# Altium project Testkit_Interposer.PrjPcb
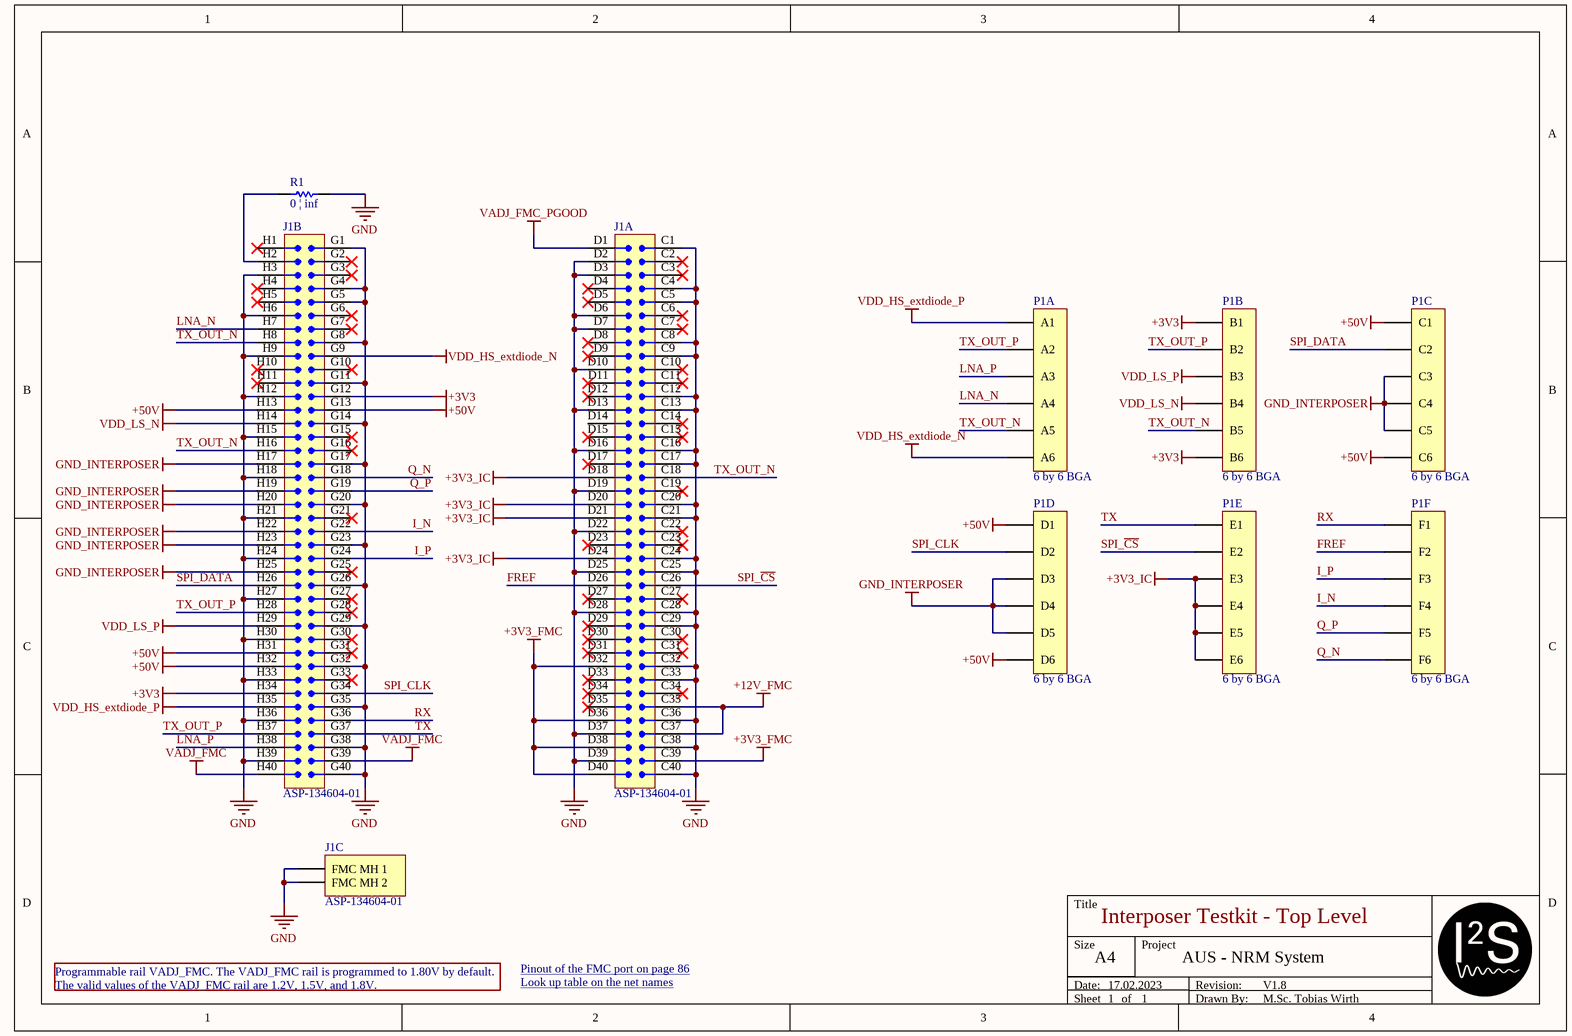
[diagram p0: Top_Level.SchDoc]
SCH_REV: A; PCB_REV: A; PCB_PART_NUMBER: <PCB PN>; PCB_ENGINEER_APP_DATE: --/--/----; PCB_ENGINEER: - -----; PCB_DWG_NO: <PCB DWG NO>; PCB_DESIGNER_APP_DATE: --/--/----; PCB_DESIGNER: - -----; PCB_CHECKER_APP_DATE: --/--/----; PCB_CHECKER: - -----; PCB_ASSEMBLY_NO: <PCB ASSY NO>; PCB_ANG_TOL: +/-1/2; PCB_3_DEC_TOL: +/-.010; PCB_2_DEC_TOL: +/-.01; DOC_NO_SCH_DWG: <SCH DWG NO>; DOC_NO_FAB_DWG: <FAB DWG NO>; DOC_NO_BOM: <BOM DOC NO>; DOC_NO_ASSY_DWG: <ASSY DWG NO>; CONTRACT_NUMBER: <CONTRACT NO>; CAGE_CODE: ?????
1 sheet, 3 parts. Net scope: global (net labels, ports and power ports of the same name join across sheets).
Board file: Testkit_v1.PcbDoc

## Sheet Top_Level.SchDoc: Interposer Testkit - Top Level
size A4; Date: 17.02.2023; ApprovedBy: Prof. Dr. Jens Anders; Author: M.Sc. Tobias Wirth; CompanyName: IIS; DrawnBy: M.Sc. Tobias Wirth; Engineer: M.Sc. Tobias Wirth; Organization: University of Stuttgart; Address1: Pfaffenwaldring 47; Address2: 70569 Stuttgart; Revision: V1.8; SheetNumber: 1; SheetTotal: 1; Project: Austrailia - NMR System; ENG_APP_DATE: --/--/--; DSN_APP_DATE: --/--/--; CHK_APP_DATE: --/--/--; ProjectNameAlt: AUS - NRM System; Time: 19:00

### Parts
J1  ASP-134604-01  [ASP13460401]  (parts A,B,C of 3)
P1  6 by 6 BGA  [BGA36C230P6X6_1500X1500X190 - Interposer]  (parts A,B,C,D,E,F of 6)
R1  0 | inf  [RES_0603]

### Nets
+3V3: J1.G12 J1.H34 P1.B1 P1.B6
+3V3_FMC: J1.C39 J1.D32 J1.D36 J1.D38 J1.D40
+3V3_IC: J1.D18 J1.D20 J1.D21 J1.D24 P1.E3 P1.E4 P1.E5 P1.E6
+12V_FMC: J1.C35 J1.C37
+50V: J1.G13 J1.H13 J1.H31 J1.H32 P1.C1 P1.C6 P1.D1 P1.D6
GND: J1.C1 J1.C4 J1.C5 J1.C8 J1.C9 J1.C12 J1.C13 J1.C16 J1.C17 J1.C20 J1.C21 J1.C24 J1.C25 J1.C28 J1.C29 J1.C32 J1.C33 J1.C36 J1.C38 J1.C40 J1.D2 J1.D3 J1.D6 J1.D7 J1.D10 J1.D13 J1.D16 J1.D19 J1.D22 J1.D25 J1.D28 J1.D37 J1.D39 J1.G1 J1.G4 J1.G5 J1.G8 J1.G11 J1.G14 J1.G17 J1.G20 J1.G23 J1.G26 J1.G29 J1.G32 J1.G35 J1.G38 J1.G40 J1.H3 J1.H6 J1.H9 J1.H12 J1.H15 J1.H18 J1.H21 J1.H24 J1.H27 J1.H30 J1.H33 J1.H36 J1.H39 J1.MH3(FMC_MH_1) J1.MH4(FMC_MH_2) R1.2
GND_INTERPOSER: J1.H17 J1.H19 J1.H20 J1.H22 J1.H23 J1.H25 P1.C3 P1.C4 P1.C5 P1.D3 P1.D4 P1.D5
VADJ_FMC: J1.G39 J1.H40
VADJ_FMC_PGOOD: J1.D1
VDD_HS_extdiode_N: J1.G9 P1.A6
VDD_HS_extdiode_P: J1.H35 P1.A1
VDD_LS_N: J1.H14 P1.B4
VDD_LS_P: J1.H29 P1.B3
FREF: J1.D26 P1.F2
I_N: J1.G22 P1.F4
I_P: J1.G24 P1.F3
LNA_N: J1.H7 P1.A4
LNA_P: J1.H38 P1.A3
Q_N: J1.G18 P1.F6
Q_P: J1.G19 P1.F5
RX: J1.G36 P1.F1
SPI_~{CS}: J1.C26 P1.E2
SPI_CLK: J1.G34 P1.D2
SPI_DATA: J1.H26 P1.C2
TX: J1.G37 P1.E1
TX_OUT_N: J1.C18 J1.H8 J1.H16 P1.A5 P1.B5
TX_OUT_P: J1.H28 J1.H37 P1.A2 P1.B2
NetJ1_H2: J1.H2 R1.1

Not connected (* = marked no-connect by the designer): J1 C2* C3* C6* C7* C10* C11* C14* C15* C19* C22* C23* C27* C30* C31* C34* D4* D5* D8* D9* D11* D12* D14 D15* D17* D23* D27* D29* D30* D31* D33* D34* D35* G2* G3* G6* G7* G10* G15* G16* G21* G25* G27* G28* G30* G31* G33* H1* H4* H5* H10* H11*

### Notes on the sheet
- Programmable rail VADJ_FMC. The VADJ_FMC rail is programmed to 1.80V by default.
  The valid values of the VADJ_FMC rail are 1.2V, 1.5V, and 1.8V.
- Pinout of the FMC port on page 86 <https://docs.xilinx.com/v/u/en-US/ug1267-zcu104-eval-bd>
- Look up table on the net names <https://fmchub.github.io/appendix/VITA57_FMC_HPC_LPC_SIGNALS_AND_PINOUT.html>
- Title
- Size
- Date:
- Sheet
- A4
- of
- Project
- Drawn By:
- Revision:

### Library data of the parts
J1 = ASP-134604-01: Board to Board & FPGA Mezzanine Connector [LPC - "ASP"]
P1 = BGA_6x6
R1 = Res: Part Number: *; Supplier: *; Value: 0 | inf